# Altium schematic sheet qudruped_nano.SchDoc
size A4
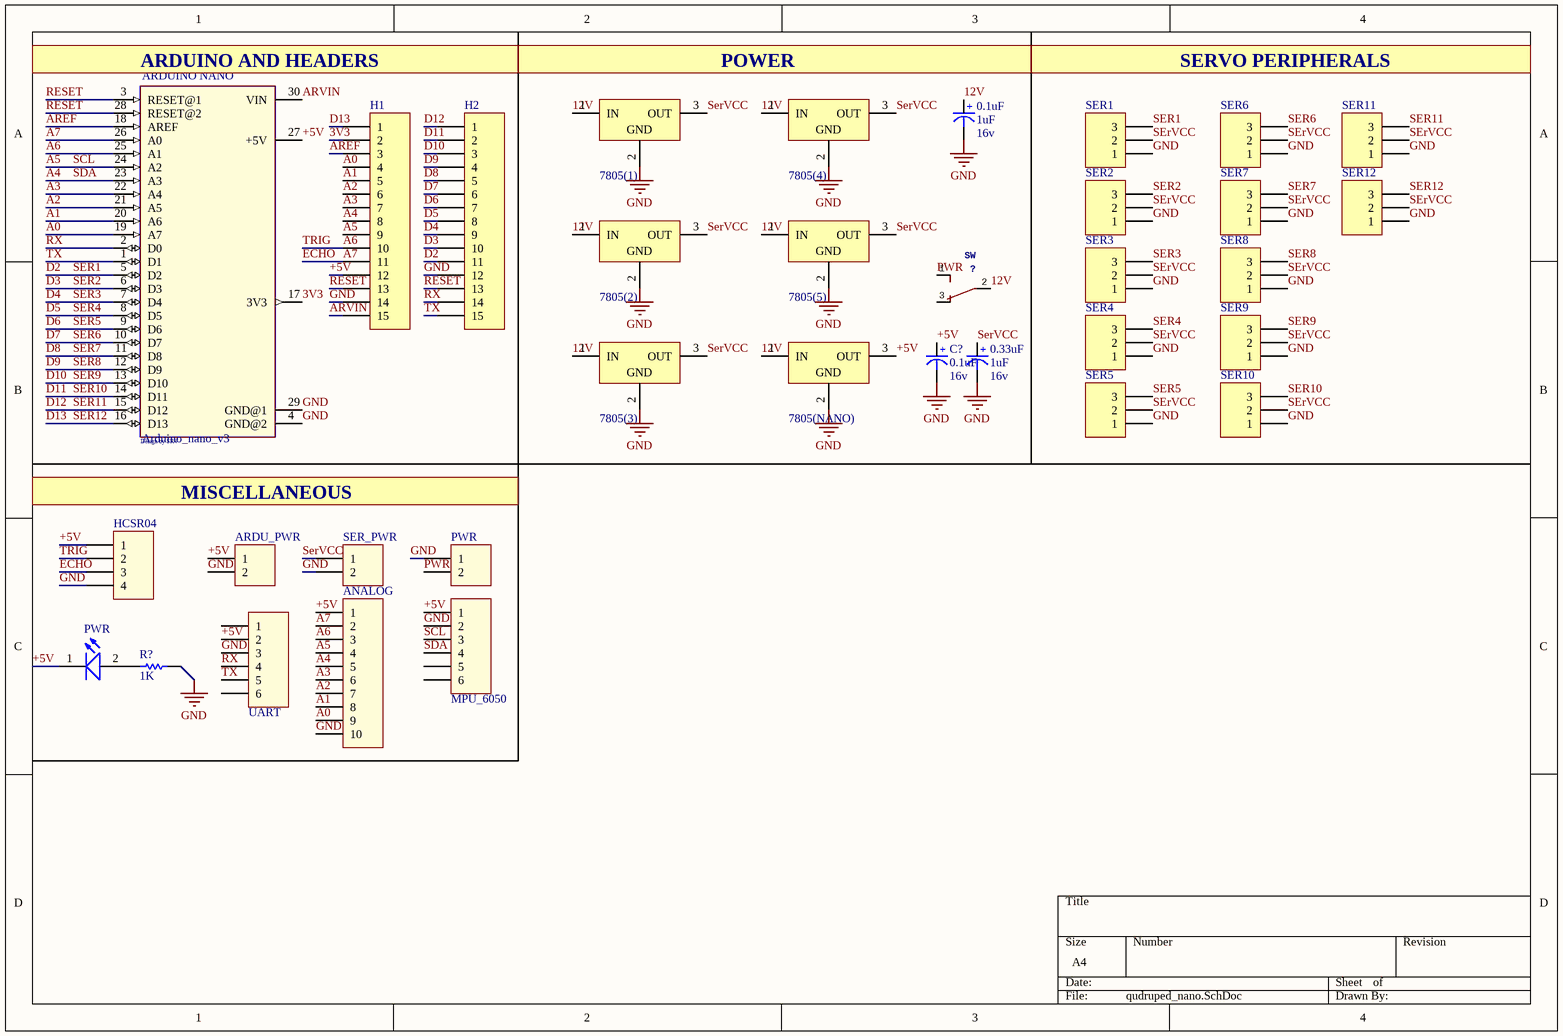
[diagram p0: qudruped_nano.SchDoc]

## Parts
(Parts that share a designator on the sheet are numbered #1, #2 ... from top to bottom, then left to right.)
0.1uF  value 1uF  Voltage: 16v  [cap-ele-02.]  (hidden comment: Capacitor_Ele)
0.33uF  value 1uF  Voltage: 16v  [cap-ele-02.]  (hidden comment: Capacitor_Ele)
7805(1)  7805CV  [TO_220.]  (value not drawn)
7805(2)  7805CV  [TO_220.]  (value not drawn)
7805(3)  7805CV  [TO_220.]  (value not drawn)
7805(4)  7805CV  [TO_220.]  (value not drawn)
7805(5)  7805CV  [TO_220.]  (value not drawn)
7805(NANO)  7805CV  [TO_220.]  (value not drawn)
?  SW  [SPDT]
ANALOG  (no value)  [61901011121]
ARDU_PWR  61900211121  [61900211121]  (value not drawn)
ARDUINO_NANO  Arduino_nano_v3  [ARDUINO_nano_V3]
C?  value 0.1uF  Voltage: 16v  [cap-ele-02.]  (hidden comment: Capacitor_Ele)
H1  WE-2.54 mm Pin Header & Jumper 61301511121  [61301511121]  (value not drawn)
H2  WE-2.54 mm Pin Header & Jumper 61301511121  [61301511121]  (value not drawn)
HCSR04  61900411121  [61900411121]  (value not drawn)
MPU_6050  61300611121  [61300611121]  (value not drawn)
PWR#1  691322110002  [691322110002]  (value not drawn)
PWR#2  151051YS04000  [WL-TMRC_5 mm]  (value not drawn)
R?  1K  [RESC3413X04N]
SER1  WE-2.54 mm Pin Header & Jumper 61300311121  [61300311121]  (value not drawn)
SER2  WE-2.54 mm Pin Header & Jumper 61300311121  [61300311121]  (value not drawn)
SER3  WE-2.54 mm Pin Header & Jumper 61300311121  [61300311121]  (value not drawn)
SER4  WE-2.54 mm Pin Header & Jumper 61300311121  [61300311121]  (value not drawn)
SER5  WE-2.54 mm Pin Header & Jumper 61300311121  [61300311121]  (value not drawn)
SER6  WE-2.54 mm Pin Header & Jumper 61300311121  [61300311121]  (value not drawn)
SER7  WE-2.54 mm Pin Header & Jumper 61300311121  [61300311121]  (value not drawn)
SER8  WE-2.54 mm Pin Header & Jumper 61300311121  [61300311121]  (value not drawn)
SER9  WE-2.54 mm Pin Header & Jumper 61300311121  [61300311121]  (value not drawn)
SER10  WE-2.54 mm Pin Header & Jumper 61300311121  [61300311121]  (value not drawn)
SER11  WE-2.54 mm Pin Header & Jumper 61300311121  [61300311121]  (value not drawn)
SER12  WE-2.54 mm Pin Header & Jumper 61300311121  [61300311121]  (value not drawn)
SER_PWR  61900211121  [61900211121]  (value not drawn)
UART  61300611121  [61300611121]  (value not drawn)

## Nets
GND: 0.1uF.2(-) 0.33uF.2(-) 7805(1).2(GND) 7805(2).2(GND) 7805(3).2(GND) 7805(4).2(GND) 7805(5).2(GND) 7805(NANO).2(GND) ANALOG.10 ARDU_PWR.2 ARDUINO_NANO.4(GND@2) ARDUINO_NANO.29(GND@1) C?.2(-) H1.14 H2.12 HCSR04.4 MPU_6050.2 PWR#1.1 R?.2 SER1.1 SER2.1 SER3.1 SER4.1 SER5.1 SER6.1 SER7.1 SER8.1 SER9.1 SER10.1 SER11.1 SER12.1 SER_PWR.2 UART.3
3V3: ARDUINO_NANO.17(3V3) H1.2
12V: 0.1uF.1(+) 7805(1).1(IN) 7805(2).1(IN) 7805(3).1(IN) 7805(4).1(IN) 7805(5).1(IN) 7805(NANO).1(IN) ?.2(P)
+5V: 7805(NANO).3(OUT) ANALOG.1 ARDU_PWR.1 ARDUINO_NANO.27(+5V) C?.1(+) H1.12 HCSR04.1 MPU_6050.1 PWR#2.1(K) UART.2
A0: ANALOG.9 ARDUINO_NANO.19(A7) H1.4
A1: ANALOG.8 ARDUINO_NANO.20(A6) H1.5
A2: ANALOG.7 ARDUINO_NANO.21(A5) H1.6
A3: ANALOG.6 ARDUINO_NANO.22(A4) H1.7
A4: ANALOG.5 ARDUINO_NANO.23(A3) H1.8 MPU_6050.4  [also labelled SDA]
A5: ANALOG.4 ARDUINO_NANO.24(A2) H1.9 MPU_6050.3  [also labelled SCL]
A6: ANALOG.3 ARDUINO_NANO.25(A1) H1.10 HCSR04.2  [also labelled TRIG]
A7: ANALOG.2 ARDUINO_NANO.26(A0) H1.11 HCSR04.3  [also labelled ECHO]
AREF: ARDUINO_NANO.18(AREF) H1.3
ARVIN: ARDUINO_NANO.30(VIN) H1.15
D2: ARDUINO_NANO.5(D2) H2.11 SER1.3  [also labelled SER1]
D3: ARDUINO_NANO.6(D3) H2.10 SER2.3  [also labelled SER2]
D4: ARDUINO_NANO.7(D4) H2.9 SER3.3  [also labelled SER3]
D5: ARDUINO_NANO.8(D5) H2.8 SER4.3  [also labelled SER4]
D6: ARDUINO_NANO.9(D6) H2.7 SER5.3  [also labelled SER5]
D7: ARDUINO_NANO.10(D7) H2.6 SER6.3  [also labelled SER6]
D8: ARDUINO_NANO.11(D8) H2.5 SER7.3  [also labelled SER7]
D9: ARDUINO_NANO.12(D9) H2.4 SER8.3  [also labelled SER8]
D10: ARDUINO_NANO.13(D10) H2.3 SER9.3  [also labelled SER9]
D11: ARDUINO_NANO.14(D11) H2.2 SER10.3  [also labelled SER10]
D12: ARDUINO_NANO.15(D12) H2.1 SER11.3  [also labelled SER11]
D13: ARDUINO_NANO.16(D13) H1.1 SER12.3  [also labelled SER12]
PWR: ?.1(NO) PWR#1.2
RESET: ARDUINO_NANO.3(RESET@1) ARDUINO_NANO.28(RESET@2) H1.13 H2.13
RX: ARDUINO_NANO.2(D0) H2.14 UART.4
SerVCC: 0.33uF.1(+) 7805(1).3(OUT) 7805(2).3(OUT) 7805(3).3(OUT) 7805(4).3(OUT) 7805(5).3(OUT) SER1.2 SER2.2 SER3.2 SER4.2 SER5.2 SER6.2 SER7.2 SER8.2 SER9.2 SER10.2 SER11.2 SER12.2 SER_PWR.1
TX: ARDUINO_NANO.1(D1) H2.15 UART.5
NetPWR#2_2: PWR#2.2(A) R?.1

Not connected (* = marked no-connect by the designer): ? 3(NC); MPU_6050 5 6; UART 1 6

## Notes on the sheet
- (near ARDUINO_NANO) ARDUINO AND HEADERS
- POWER
- SERVO PERIPHERALS
- MISCELLANEOUS
- (in symbol Arduino_nano_v3) Design by SRV

## Library data of the parts
0.1uF 0.33uF C? = Capacitor_Ele.: LatestRevisionDate: 17-Jul-2002; LatestRevisionNote: Re-released for DXP Platform.; Publisher: Altium Limited
7805(1) 7805(2) 7805(3) 7805(4) 7805(5) 7805(NANO) = 7805: LatestRevisionDate: 17-Jul-2002; LatestRevisionNote: Re-released for DXP Platform.; Publisher: Altium Limited
? = SLIDE_SWITCH
ANALOG = 61901011121: WR-WTB 2.54mm Male Locking Header, 10p; Pin Number: 10; ComponentLink1Description: Manufacturer; ComponentLink1URL: http://www.we-online.de; ComponentLink2Description: Datasheet; ComponentLink2URL: http://katalog.we-online.de/em/datasheet/6190xx11121.pdf; Part Number: 61901011121; Published Date: June 2017; Publisher: Wurth Elektronik; Pitch: 2.54 mm
ARDU_PWR SER_PWR = 61900211121: WR-WTB 2.54mm Male Locking Header, 2p; Pin Number: 2; ComponentLink1Description: Manufacturer; ComponentLink1URL: http://www.we-online.de; ComponentLink2Description: Datasheet; ComponentLink2URL: http://katalog.we-online.de/em/datasheet/6190xx11121.pdf; Part Number: 61900211121; Published Date: June 2017; Publisher: Wurth Elektronik; Pitch: 2.54 mm
ARDUINO_NANO = Arduino_nano_v3: Design by: Seyed Razi Vesali; Telegram :: @seyedrazivesali; Email :: razi.vesali@gmail.com; Phone :: +989365750371; Website :: www.robotic-technology.ir
H1 H2 = WE-2.54 mm Pin Header & Jumper 61301511121: WR-PHD 2.54mm Pin Header; Manufacturer: W¨¹rth Elektronik eiSos GmbH; ComponentLink1 Description: Manufacturer; ComponentLink2 Description: Datasheet; NoPins: 01; Created Date: 22 March 2013; partNo: 61301511121; ComponentLink1URL: http://www.we-online.com; ComponentLink2URL: http://katalog.we-online.de/em/datasheet/6130xx11121.pdf; Created by: Karrer Zheng
HCSR04 = 61900411121: WR-WTB 2.54mm Male Locking Header, 4p; Pin Number: 4; ComponentLink1Description: Manufacturer; ComponentLink1URL: http://www.we-online.de; ComponentLink2Description: Datasheet; ComponentLink2URL: http://katalog.we-online.de/em/datasheet/6190xx11121.pdf; Part Number: 61900411121; Published Date: June 2017; Publisher: Wurth Elektronik; Pitch: 2.54 mm
MPU_6050 UART = 61300611121: WR-PHD 2.54 mm THT Pin Header, 6p; Pin Number: 6; Rated Current: 3 A; Working Voltage: 250 VAC; Withstanding Voltage: 500 VAC; Pitch: 2.54 mm; ComponentLink1Description: Manufacturer; ComponentLink1URL: http://www.we-online.de; ComponentLink2Description: Datasheet; ComponentLink2URL: http://katalog.we-online.de/em/datasheet/6130xx11121.pdf; Part Number: 61300611121; Published Date: Aug 2017; Publisher: Wurth Elektronik
PWR#1 = 691322110002: WR-TBL Serie 3221 - 3.50 mm Horizontal PCB Header, 02p; Pitch: 3.5 mm; Published Date: Jan 2017; Publisher: Wurth Elektronik; ComponentLink1Description: Manufacturer; ComponentLink1URL: http://www.we-online.de; ComponentLink2Description: Datasheet; ComponentLink2URL: http://katalog.we-online.de/em/datasheet/6913221100xx.pdf; Part Number: 691322110002; Pin Number: 02p
PWR#2 = 151051YS04000: WL-TMRC THT Mono-color Round Color, 5 mm, Yellow; Forward Voltage: 2 V; Viewing Angle: 40°; Luminous Intensity: 450 mcd; Published Date: Jan 2017; Publisher: Wurth Elektronik; ComponentLink1Description: Manufacturer; ComponentLink1URL: http://www.we-online.de; ComponentLink2Description: Datasheet; ComponentLink2URL: http://katalog.we-online.de/led/datasheet/151051YS04000.pdf; Part Number: 151051YS04000; Size: 5 mm; Emitting Color: Yellow
R? = RES 0805 0.125W: RES 0805; Designer: Abbas Basereh; Desc.: RES SMD 0805; Data: 16-12-2016
SER1-SER12 = WE-2.54 mm Pin Header & Jumper 61300311121: WR-PHD 2.54mm Pin Header; Manufacturer: W¨¹rth Elektronik eiSos GmbH; ComponentLink1 Description: Manufacturer; ComponentLink2 Description: Datasheet; NoPins: 03; Created Date: 22 March 2013; partNo: 61300311121; ComponentLink1URL: http://www.we-online.com; ComponentLink2URL: http://katalog.we-online.de/em/datasheet/6130xx11121.pdf; Created by: Karrer Zheng